# EAGLE schematic ECG_Power (EAGLE 6.4)
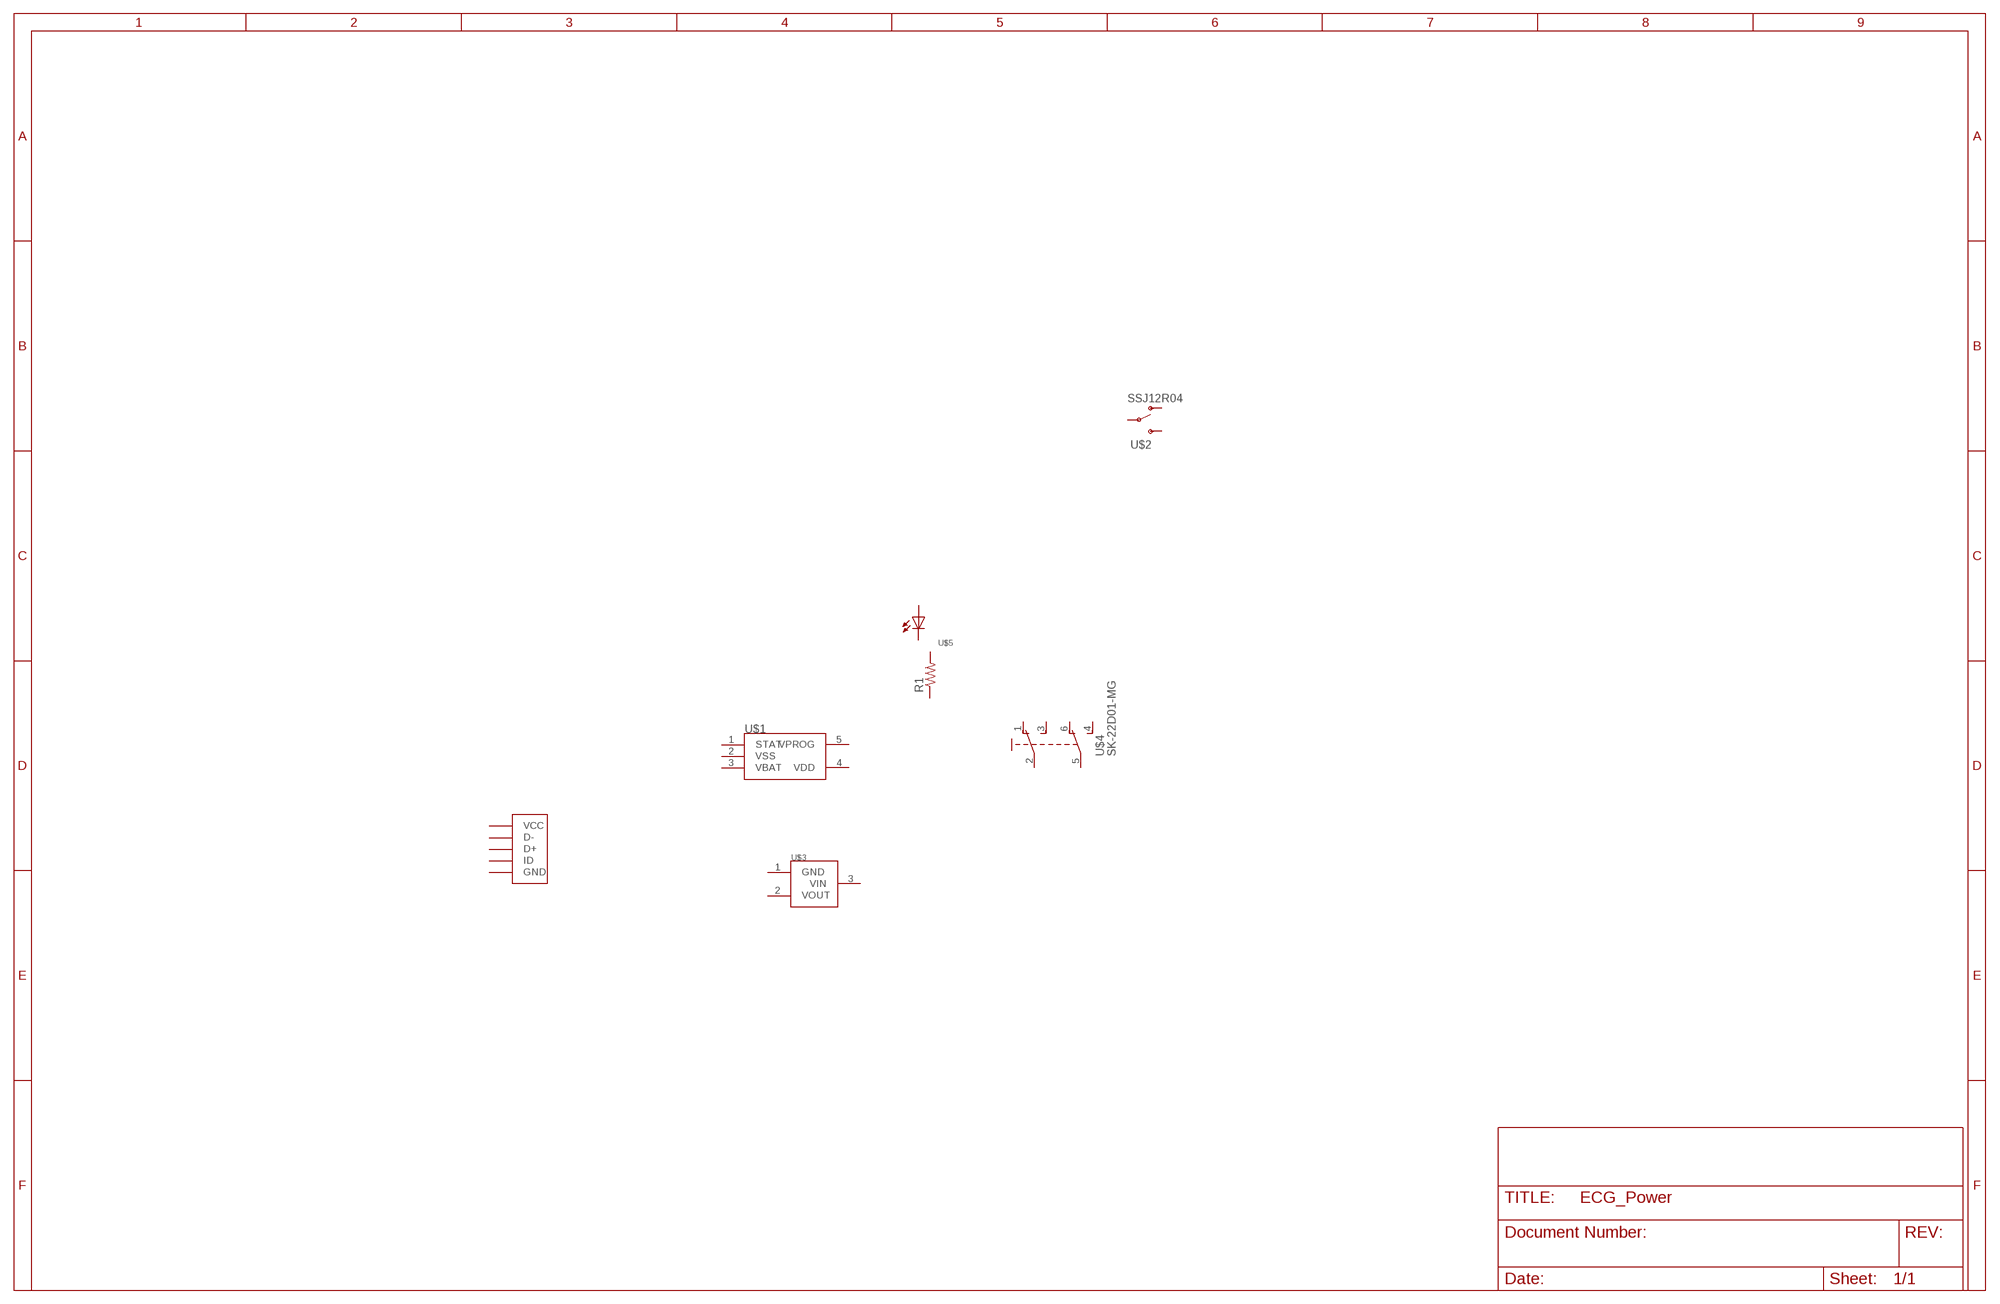
[diagram p0: schematic, sheet 1]

## Parts
J1  USB_MICROC  [USB_MICROB_FEMALE_RA_SMT]
R1  R-US_R0603  [R0603]
U$1  MCP73832_SOT23-5  [SOT23-5]
U$2  SSJ12R04  [SSJ12R04]
U$3  MCP1703  [SOT23]
U$4  SK-22D01-MG  [SK]
U$5  LED_SMT_0805  [SMT_LED_0805]
Unconnected: J1.P$1(VCC) J1.P$2(D-) J1.P$3(D+) J1.P$4(ID) J1.P$5(GND) R1.1 R1.2 U$1.1(STAT) U$1.2(VSS) U$1.3(VBAT) U$1.4(VDD) U$1.5(VPROG) U$2.1(O) U$2.2(P) U$2.3(S) U$3.1(GND) U$3.2(VOUT) U$3.3(VIN) U$4.1(O) U$4.2(P) U$4.3(S) U$4.4(S1) U$4.5(P1) U$4.6(O1) U$5.A U$5.C

## Library data of the parts
J1 = KomodoOpenLab:USB_MICROC; DIGIKEY: WM1399CT-ND; PN: ZX62D-B-5PA8
R1 = rcl:R-US_: RESISTOR, American symbol
U$1 = KomodoOpenLab:MCP73832_SOT23-5
U$2 = KomodoOpenLab:SSJ12R04
U$3 = microchip_regulators:MCP1703
U$4 = ck_components:SK-22D01-MG
U$5 = LITEON:LED_SMT_0805